# Altium project HPBIController.PrjPCB (part 1 of 2)
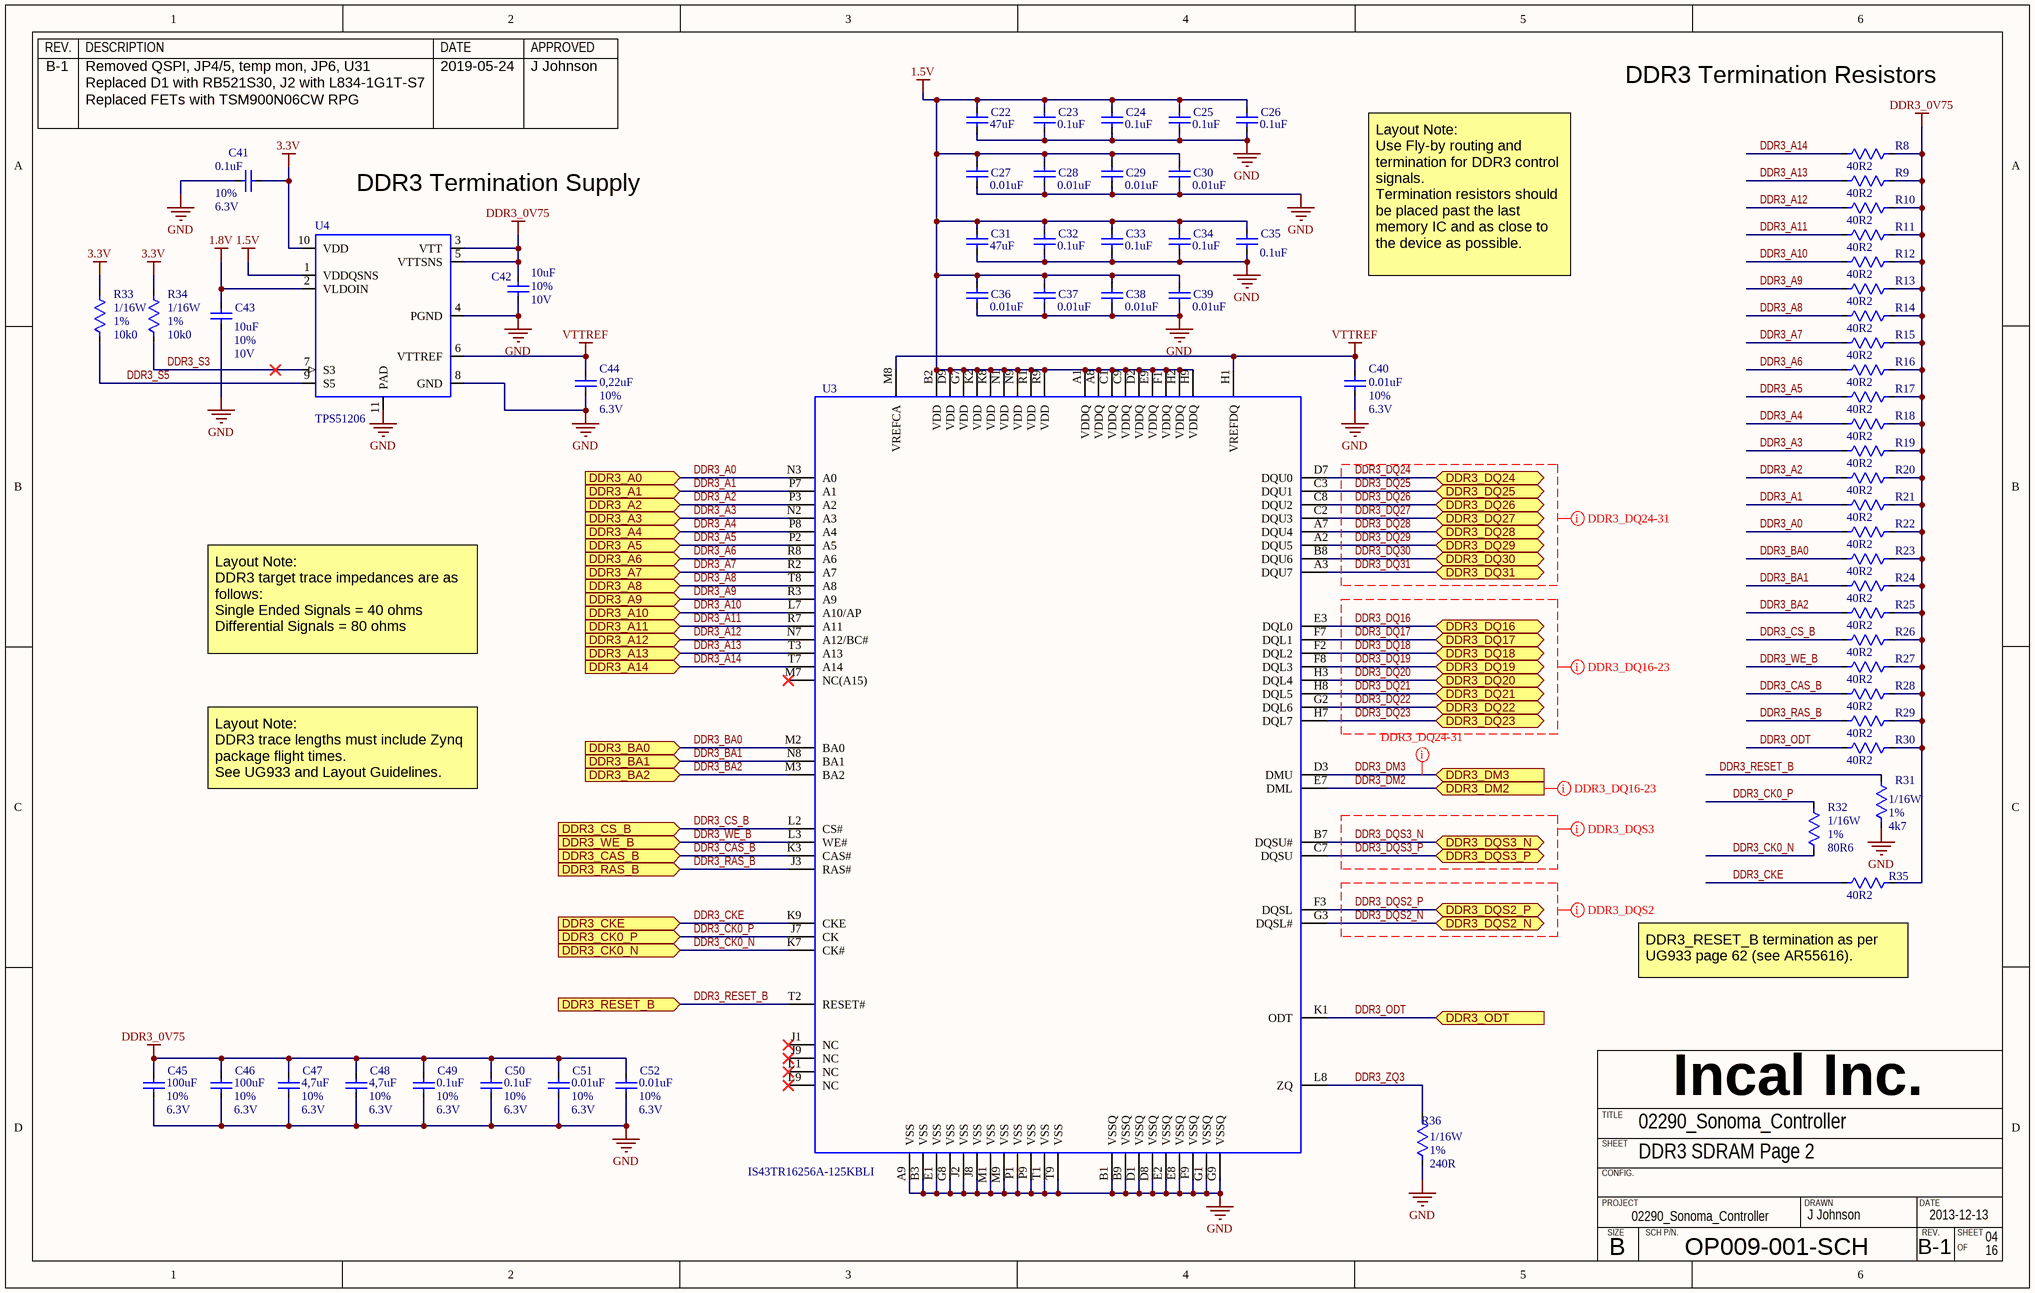
[diagram p0: DDR3B.SchDoc]
7 sheets, 255 parts. Net scope: hierarchical (ports join the sheet entries above them; power ports are global).
Board file: HPBIController-1.PcbDoc
Sheets:
  BlockDiagram.SchDoc
  DDR3B.SchDoc
  QSPIFlash.SchDoc
  Bank34-35.SchDoc
  Power.SchDoc
  ADC.SchDoc
  DAC.SchDoc

## Sheet BlockDiagram.SchDoc: 02290_Sonoma_Controller
size B; ApprovedBy: J Johnson; CheckedBy: J Johnson; Author: sdfasdfdfAEFfasdFfaF; DrawnBy: J Johnson; Organization: Opsero Electronic Design; Address1: 21-915 Av. Marguerite-Bourgeoys; Address2: Québec (QC); Address3: G1S 3X4; DocumentNumber: OP009-001-SCH; Revision: B-1; SheetNumber: 02; SheetTotal: 16; Tel1: (581) 308-8830; Tel2: (581) 308-8830; Project: 02290_Sonoma_Controller; CheckedDate: 2013-12-13; Sheet: Block diagram; PageSetup: Record=PageOptions|CenterHorizontal=True|CenterVertical=True|PrintScale=1.08|XCorrection=1.00|YCorrection=1.00|PrintKind=0|BorderSize=5000000|LeftOffset=0|BottomOffset=0|Orientation=2|PaperLength=1000|PaperWidth=1000|Scale=100|PaperSource=7|PrintQuality=-4|MediaType=1|DitherType=10|PaperKind=Tabloid     [11 x 17 in]|PrintScaleMode=1; DrawDate: 2013-12-13; SchTitle: 02290_Sonoma_Controller; RevDescription: Removed QSPI, JP4/5, temp mon, JP6, U31; RevDate: 2019-05-24; RevBy: J Johnson; RevDescription2: Replaced D1 with RB521S30, J2 with L834-1G1T-S7; RevDescription3: Replaced FETs with TSM900N06CW RPG

### Notes on the sheet
- REV.
- DESCRIPTION
- DATE
- APPROVED
- Incal Inc.
- SHEET
- TITLE
- CONFIG.
- PROJECT
- SIZE
- SCH P/N.
- DRAWN
- B
- OF

## Sheet DDR3B.SchDoc: 02290_Sonoma_Controller
size B; ApprovedBy: J Johnson; CheckedBy: J Johnson; Author: sdfasdfdfAEFfasdFfaF; DrawnBy: J Johnson; Organization: Opsero Electronic Design; Address1: 21-915 Av. Marguerite-Bourgeoys; Address2: Québec (QC); Address3: G1S 3X4; DocumentNumber: OP009-001-SCH; Revision: B-1; SheetNumber: 04; SheetTotal: 16; Tel1: (581) 308-8830; Tel2: (581) 308-8830; Project: 02290_Sonoma_Controller; CheckedDate: 2013-12-13; Sheet: DDR3 SDRAM Page 2; PageSetup: Record=PageOptions|CenterHorizontal=True|CenterVertical=True|PrintScale=1.08|XCorrection=1.00|YCorrection=1.00|PrintKind=0|BorderSize=5000000|LeftOffset=0|BottomOffset=0|Orientation=2|PaperLength=1000|PaperWidth=1000|Scale=100|PaperSource=7|PrintQuality=-4|MediaType=1|DitherType=10|PaperKind=Tabloid     [11 x 17 in]|PrintScaleMode=1; DrawDate: 2013-12-13; SchTitle: 02290_Sonoma_Controller; RevDescription: Removed QSPI, JP4/5, temp mon, JP6, U31; RevDate: 2019-05-24; RevBy: J Johnson; RevDescription2: Replaced D1 with RB521S30, J2 with L834-1G1T-S7; RevDescription3: Replaced FETs with TSM900N06CW RPG

### Parts
C22  value 47uF  [CAPC2013X125N]  (hidden comment: CAPACITOR_NP_TYPE1)
C23  value 0.1uF  [CAPC0603X33N]  (hidden comment: CAPACITOR_NP_TYPE1)
C24  value 0.1uF  [CAPC0603X33N]  (hidden comment: CAPACITOR_NP_TYPE1)
C25  value 0.1uF  [CAPC0603X33N]  (hidden comment: CAPACITOR_NP_TYPE1)
C26  value 0.1uF  [CAPC0603X33N]  (hidden comment: CAPACITOR_NP_TYPE1)
C27  value 0.01uF  [CAPC0603X33N]  (hidden comment: CAPACITOR_NP_TYPE1)
C28  value 0.01uF  [CAPC0603X33N]  (hidden comment: CAPACITOR_NP_TYPE1)
C29  value 0.01uF  [CAPC0603X33N]  (hidden comment: CAPACITOR_NP_TYPE1)
C30  value 0.01uF  [CAPC0603X33N]  (hidden comment: CAPACITOR_NP_TYPE1)
C31  value 47uF  [CAPC2013X125N]  (hidden comment: CAPACITOR_NP_TYPE1)
C32  value 0.1uF  [CAPC0603X33N]  (hidden comment: CAPACITOR_NP_TYPE1)
C33  value 0.1uF  [CAPC0603X33N]  (hidden comment: CAPACITOR_NP_TYPE1)
C34  value 0.1uF  [CAPC0603X33N]  (hidden comment: CAPACITOR_NP_TYPE1)
C35  value 0.1uF  [CAPC0603X33N]  (hidden comment: CAPACITOR_NP_TYPE1)
C36  value 0.01uF  [CAPC0603X33N]  (hidden comment: CAPACITOR_NP_TYPE1)
C37  value 0.01uF  [CAPC0603X33N]  (hidden comment: CAPACITOR_NP_TYPE1)
C38  value 0.01uF  [CAPC0603X33N]  (hidden comment: CAPACITOR_NP_TYPE1)
C39  value 0.01uF  [CAPC0603X33N]  (hidden comment: CAPACITOR_NP_TYPE1)
C40  value 0.01uF  Tolerance: 10%  Voltage: 6.3V  [CAPC0603X33N]  (hidden comment: CAPACITOR_NP_TYPE1)
C41  value 0.1uF  Tolerance: 10%  Voltage: 6.3V  [CAPC0603X33N]  (hidden comment: CAPACITOR_NP_TYPE1)
C42  value 10uF  Tolerance: 10%  Voltage: 10V  [CAPC1608X38N]  (hidden comment: CAPACITOR_NP_TYPE1)
C43  value 10uF  Tolerance: 10%  Voltage: 10V  [CAPC1608X38N]  (hidden comment: CAPACITOR_NP_TYPE1)
C44  value 0,22uF  Tolerance: 10%  Voltage: 6.3V  [CAPC1005X55N]  (hidden comment: CAPACITOR_NP_TYPE1)
C45  value 100uF  Tolerance: 10%  Voltage: 6.3V  [CAPC3225X250N]  (hidden comment: CAPACITOR_NP_TYPE1)
C46  value 100uF  Tolerance: 10%  Voltage: 6.3V  [CAPC3225X250N]  (hidden comment: CAPACITOR_NP_TYPE1)
C47  value 4,7uF  Tolerance: 10%  Voltage: 6.3V  [CAPC1005X33N]  (hidden comment: CAPACITOR_NP_TYPE1)
C48  value 4,7uF  Tolerance: 10%  Voltage: 6.3V  [CAPC1005X33N]  (hidden comment: CAPACITOR_NP_TYPE1)
C49  value 0.1uF  Tolerance: 10%  Voltage: 6.3V  [CAPC0603X33N]  (hidden comment: CAPACITOR_NP_TYPE1)
C50  value 0.1uF  Tolerance: 10%  Voltage: 6.3V  [CAPC0603X33N]  (hidden comment: CAPACITOR_NP_TYPE1)
C51  value 0.01uF  Tolerance: 10%  Voltage: 6.3V  [CAPC0603X33N]  (hidden comment: CAPACITOR_NP_TYPE1)
C52  value 0.01uF  Tolerance: 10%  Voltage: 6.3V  [CAPC0603X33N]  (hidden comment: CAPACITOR_NP_TYPE1)
R8  value 40R2  [RESC1005X33N]  (hidden comment: *)
R9  value 40R2  [RESC1005X33N]  (hidden comment: *)
R10  value 40R2  [RESC1005X33N]  (hidden comment: *)
R11  value 40R2  [RESC1005X33N]  (hidden comment: *)
R12  value 40R2  [RESC1005X33N]  (hidden comment: *)
R13  value 40R2  [RESC1005X33N]  (hidden comment: *)
R14  value 40R2  [RESC1005X33N]  (hidden comment: *)
R15  value 40R2  [RESC1005X33N]  (hidden comment: *)
R16  value 40R2  [RESC1005X33N]  (hidden comment: *)
R17  value 40R2  [RESC1005X33N]  (hidden comment: *)
R18  value 40R2  [RESC1005X33N]  (hidden comment: *)
R19  value 40R2  [RESC1005X33N]  (hidden comment: *)
R20  value 40R2  [RESC1005X33N]  (hidden comment: *)
R21  value 40R2  [RESC1005X33N]  (hidden comment: *)
R22  value 40R2  [RESC1005X33N]  (hidden comment: *)
R23  value 40R2  [RESC1005X33N]  (hidden comment: *)
R24  value 40R2  [RESC1005X33N]  (hidden comment: *)
R25  value 40R2  [RESC1005X33N]  (hidden comment: *)
R26  value 40R2  [RESC1005X33N]  (hidden comment: *)
R27  value 40R2  [RESC1005X33N]  (hidden comment: *)
R28  value 40R2  [RESC1005X33N]  (hidden comment: *)
R29  value 40R2  [RESC1005X33N]  (hidden comment: *)
R30  value 40R2  [RESC1005X33N]  (hidden comment: *)
R31  value 4k7  Power: 1/16W  Tolerance: 1%  [RESC1005X33N]  (hidden comment: *)
R32  value 80R6  Power: 1/16W  Tolerance: 1%  [RESC1005X33N]  (hidden comment: *)
R33  value 10k0  Power: 1/16W  Tolerance: 1%  [RESC1005X33N]  (hidden comment: *)
R34  value 10k0  Power: 1/16W  Tolerance: 1%  [RESC1005X33N]  (hidden comment: *)
R35  value 40R2  [RESC1005X33N]  (hidden comment: *)
R36  value 240R  Power: 1/16W  Tolerance: 1%  [RESC1005X33N]  (hidden comment: *)
U3  IS43TR16256A-125KBLI  [BGA96C80P6X16_900X1300X120]
U4  TPS51206  [DFN40P200X200X75-11N]

### Ports
DDR3_A0 (in), DDR3_A1 (in), DDR3_A2 (in), DDR3_A3 (in), DDR3_A4 (in), DDR3_A5 (in), DDR3_A6 (in), DDR3_A7 (in), DDR3_A8 (in), DDR3_A9 (in), DDR3_A10 (in), DDR3_A11 (in), DDR3_A12 (in), DDR3_A13 (in), DDR3_A14 (in), DDR3_BA0 (in), DDR3_BA1 (in), DDR3_BA2 (in), DDR3_CAS_B (in), DDR3_CK0_N (in), DDR3_CK0_P (in), DDR3_CKE (in), DDR3_CS_B (in), DDR3_DM2 (in), DDR3_DM3 (in), DDR3_DQ16 (bidir), DDR3_DQ17 (bidir), DDR3_DQ18 (bidir), DDR3_DQ19 (bidir), DDR3_DQ20 (bidir), DDR3_DQ21 (bidir), DDR3_DQ22 (bidir), DDR3_DQ23 (bidir), DDR3_DQ24 (bidir), DDR3_DQ25 (bidir), DDR3_DQ26 (bidir), DDR3_DQ27 (bidir), DDR3_DQ28 (bidir), DDR3_DQ29 (bidir), DDR3_DQ30 (bidir), DDR3_DQ31 (bidir), DDR3_DQS2_N (bidir), DDR3_DQS2_P (bidir), DDR3_DQS3_N (bidir), DDR3_DQS3_P (bidir), DDR3_ODT (in), DDR3_RAS_B (in), DDR3_RESET_B (in), DDR3_WE_B (in)

### Nets
1.5V: C22.1 C23.1 C24.1 C25.1 C26.1 C27.1 C28.1 C29.1 C30.1 C31.1 C32.1 C33.1 C34.1 C35.1 C36.1 C37.1 C38.1 C39.1 U3.A1(VDDQ) U3.A8(VDDQ) U3.B2(VDD) U3.C1(VDDQ) U3.C9(VDDQ) U3.D2(VDDQ) U3.D9(VDD) U3.E9(VDDQ) U3.F1(VDDQ) U3.G7(VDD) U3.H2(VDDQ) U3.H9(VDDQ) U3.K2(VDD) U3.K8(VDD) U3.N1(VDD) U3.N9(VDD) U3.R1(VDD) U3.R9(VDD) U4.1(VDDQSNS)
1.8V: C43.1 U4.2(VLDOIN)
3.3V: C41.1 R33.1 R34.1 U4.10(VDD)
DDR3_0V75: C42.1 C45.1 C46.1 C47.1 C48.1 C49.1 C50.1 C51.1 C52.1 R8.1 R9.1 R10.1 R11.1 R12.1 R13.1 R14.1 R15.1 R16.1 R17.1 R18.1 R19.1 R20.1 R21.1 R22.1 R23.1 R24.1 R25.1 R26.1 R27.1 R28.1 R29.1 R30.1 R35.1 U4.3(VTT) U4.5(VTTSNS)
GND: C22.2 C23.2 C24.2 C25.2 C26.2 C27.2 C28.2 C29.2 C30.2 C31.2 C32.2 C33.2 C34.2 C35.2 C36.2 C37.2 C38.2 C39.2 C40.2 C41.2 C42.2 C43.2 C44.2 C45.2 C46.2 C47.2 C48.2 C49.2 C50.2 C51.2 C52.2 R31.2 R36.1 U3.A9(VSS) U3.B1(VSSQ) U3.B3(VSS) U3.B9(VSSQ) U3.D1(VSSQ) U3.D8(VSSQ) U3.E1(VSS) U3.E2(VSSQ) U3.E8(VSSQ) U3.F9(VSSQ) U3.G1(VSSQ) U3.G8(VSS) U3.G9(VSSQ) U3.J2(VSS) U3.J8(VSS) U3.M1(VSS) U3.M9(VSS) U3.P1(VSS) U3.P9(VSS) U3.T1(VSS) U3.T9(VSS) U4.4(PGND) U4.8(GND) U4.11(PAD)
VTTREF: C40.1 C44.1 U3.H1(VREFDQ) U3.M8(VREFCA) U4.6(VTTREF)
DDR3_A0: R22.2 U3.N3(A0) ; port DDR3_A0
DDR3_A1: R21.2 U3.P7(A1) ; port DDR3_A1
DDR3_A2: R20.2 U3.P3(A2) ; port DDR3_A2
DDR3_A3: R19.2 U3.N2(A3) ; port DDR3_A3
DDR3_A4: R18.2 U3.P8(A4) ; port DDR3_A4
DDR3_A5: R17.2 U3.P2(A5) ; port DDR3_A5
DDR3_A6: R16.2 U3.R8(A6) ; port DDR3_A6
DDR3_A7: R15.2 U3.R2(A7) ; port DDR3_A7
DDR3_A8: R14.2 U3.T8(A8) ; port DDR3_A8
DDR3_A9: R13.2 U3.R3(A9) ; port DDR3_A9
DDR3_A10: R12.2 U3.L7(A10/AP) ; port DDR3_A10
DDR3_A11: R11.2 U3.R7(A11) ; port DDR3_A11
DDR3_A12: R10.2 U3.N7(A12/BC#) ; port DDR3_A12
DDR3_A13: R9.2 U3.T3(A13) ; port DDR3_A13
DDR3_A14: R8.2 U3.T7(A14) ; port DDR3_A14
DDR3_BA0: R23.2 U3.M2(BA0) ; port DDR3_BA0
DDR3_BA1: R24.2 U3.N8(BA1) ; port DDR3_BA1
DDR3_BA2: R25.2 U3.M3(BA2) ; port DDR3_BA2
DDR3_CAS_B: R28.2 U3.K3(CAS#) ; port DDR3_CAS_B
DDR3_CK0_N: R32.1 U3.K7(CK#) ; port DDR3_CK0_N
DDR3_CK0_P: R32.2 U3.J7(CK) ; port DDR3_CK0_P
DDR3_CKE: R35.2 U3.K9(CKE) ; port DDR3_CKE
DDR3_CS_B: R26.2 U3.L2(CS#) ; port DDR3_CS_B
DDR3_DM2: U3.E7(DML) ; port DDR3_DM2
DDR3_DM3: U3.D3(DMU) ; port DDR3_DM3
DDR3_DQ16: U3.E3(DQL0) ; port DDR3_DQ16
DDR3_DQ17: U3.F7(DQL1) ; port DDR3_DQ17
DDR3_DQ18: U3.F2(DQL2) ; port DDR3_DQ18
DDR3_DQ19: U3.F8(DQL3) ; port DDR3_DQ19
DDR3_DQ20: U3.H3(DQL4) ; port DDR3_DQ20
DDR3_DQ21: U3.H8(DQL5) ; port DDR3_DQ21
DDR3_DQ22: U3.G2(DQL6) ; port DDR3_DQ22
DDR3_DQ23: U3.H7(DQL7) ; port DDR3_DQ23
DDR3_DQ24: U3.D7(DQU0) ; port DDR3_DQ24
DDR3_DQ25: U3.C3(DQU1) ; port DDR3_DQ25
DDR3_DQ26: U3.C8(DQU2) ; port DDR3_DQ26
DDR3_DQ27: U3.C2(DQU3) ; port DDR3_DQ27
DDR3_DQ28: U3.A7(DQU4) ; port DDR3_DQ28
DDR3_DQ29: U3.A2(DQU5) ; port DDR3_DQ29
DDR3_DQ30: U3.B8(DQU6) ; port DDR3_DQ30
DDR3_DQ31: U3.A3(DQU7) ; port DDR3_DQ31
DDR3_DQS2_N: U3.G3(DQSL#) ; port DDR3_DQS2_N
DDR3_DQS2_P: U3.F3(DQSL) ; port DDR3_DQS2_P
DDR3_DQS3_N: U3.B7(DQSU#) ; port DDR3_DQS3_N
DDR3_DQS3_P: U3.C7(DQSU) ; port DDR3_DQS3_P
DDR3_ODT: R30.2 U3.K1(ODT) ; port DDR3_ODT
DDR3_RAS_B: R29.2 U3.J3(RAS#) ; port DDR3_RAS_B
DDR3_RESET_B: R31.1 U3.T2(RESET#) ; port DDR3_RESET_B
DDR3_S3: R34.2 U4.7(S3)
DDR3_S5: R33.2 U4.9(S5)
DDR3_WE_B: R27.2 U3.L3(WE#) ; port DDR3_WE_B
DDR3_ZQ3: R36.2 U3.L8(ZQ)

Not connected (* = marked no-connect by the designer): U3 J1(NC)* J9(NC)* L1(NC)* L9(NC)* M7(NC(A15))*

### Layout directives
net class DDR3_DQ3(24-31): DDR3_DM3, DDR3_DQ24, DDR3_DQ25, DDR3_DQ26, DDR3_DQ27, DDR3_DQ28, DDR3_DQ29, DDR3_DQ30, DDR3_DQ31
net class DDR3_DQ2(16-23): DDR3_DM2, DDR3_DQ16, DDR3_DQ17, DDR3_DQ18, DDR3_DQ19, DDR3_DQ20, DDR3_DQ21, DDR3_DQ22, DDR3_DQ23
net class DDR3_DQS3: DDR3_DQS3_N, DDR3_DQS3_P
net class DDR3_DQS2: DDR3_DQS2_N, DDR3_DQS2_P

### Notes on the sheet
- DDR3 Termination Resistors
- (near U4) DDR3 Termination Supply
- Layout Note:
  Use Fly-by routing and termination for DDR3 control signals.
  Termination resistors should be placed past the last memory IC and as close to the device as possible.
- Layout Note:
  DDR3 target trace impedances are as follows:
  Single Ended Signals = 40 ohms
  Differential Signals = 80 ohms
- Layout Note:
  DDR3 trace lengths must include Zynq package flight times.
  See UG933 and Layout Guidelines.
- (near R35) DDR3_RESET_B termination as per UG933 page 62 (see AR55616).
- REV.
- DESCRIPTION
- DATE
- APPROVED
- Incal Inc.
- SHEET
- TITLE
- CONFIG.
- PROJECT
- SIZE
- SCH P/N.
- DRAWN
- B
- OF

### Library data of the parts
C22 C31 = C0805_47uF_10%_25V_X5R: Capacitor ceramic, X5R, 47uF, 6.3V, 20%, -55 to +85 C,; Manufacturer 1: Taiyo; Mfg Part Number 1: JMK212BJ476MG-T; EIA(I) Package: 0805; EIA(M) Package: 2012; ASSY: USED; Status: Active; Power: *; Current: *; Part Ref: C0805_47uF_10%_25V_X5R; Comment_1: *; RoHs: True; Tolerance: 20%; Voltage: 6.3V; Operating Temp: -55 to +85 C
C23-C26 C32-C35 C41 C49 C50 = C0201_0.1uF_10%_6.3V_X5R: Capacitor ceramic, X5R, 0.1uF, 6.3V, 10%, -55 to +125 C, EIA0201; Manufacturer 1: Murata; Mfg Part Number 1: GRM033R60J104KE19D; EIA(I) Package: 0201; EIA(M) Package: 0603; ASSY: USED; Status: Active; Power: *; Current: *; Part Ref: C0201_0.1uF_10%_6.3V_X5R; Comment_1: *; RoHs: True; Operating Temp: -55 to +85 C
  C23-C26 C32-C35: Tolerance: 10%; Voltage: 6.3V
C27-C30 C36-C40 C51 C52 = C0201_0.01uF_10%_6.3V_X5R: Capacitor ceramic, X5R, 0.01uF, 6.3V, 10%, -55 to +125 C, EIA0201; Manufacturer 1: Murata; Mfg Part Number 1: GRM033R60J103KA01D; EIA(I) Package: 0201; EIA(M) Package: 0603; ASSY: USED; Status: Active; Power: *; Current: *; Part Ref: C0201_0.01uF_10%_6.3V_X5R; Comment_1: *; RoHs: True; Operating Temp: -55 to +85 C
  C27-C30 C36-C39: Tolerance: 10%; Voltage: 6.3V
C42 C43 = C0603_10uF_10%_10V_X5R: Capacitor ceramic, X5R, 10uF, 10V, 10%, -55 to +85 C, EIA0603; Manufacturer 1: TDK Corporation; Mfg Part Number 1: C1608X5R1A106K080AC; EIA(I) Package: 0603; EIA(M) Package: 1608; ASSY: USED; Status: Active; Power: *; Current: *; Part Ref: C0603_10uF_10%_10V_X5R; Comment_1: *; RoHs: True; Operating Temp: -55 to +85 C
C44 = C0402_0.22uF_10%_6.3V_X5R: Capacitor ceramic, X5R, 0.22uF, 6.3V, 10%, -55 to +85 C, EIA0402; Manufacturer 1: AVX; Mfg Part Number 1: 04026D224KAT2A; EIA(I) Package: 0402; EIA(M) Package: 1005; ASSY: USED; Status: Active; Power: *; Current: *; Part Ref: C0402_0.22uF_10%_6.3V_X5R; Comment_1: *; RoHs: True; Operating Temp: -55 to +85 C
C45 C46 = C1210_100uF_10%_6.3V_X5R: Capacitor ceramic, X5R, 100uF, 6.3V, 10%, -55 to +85 C, EIA1210; Manufacturer 1: Murata; Mfg Part Number 1: GRM32EF50J107ZE20K; EIA(I) Package: 1210; EIA(M) Package: 3225; ASSY: USED; Status: Active; Power: *; Current: *; Part Ref: C1210_100uF_10%_6.3V_X5R; Comment_1: *; RoHs: True; Operating Temp: -55 to +85 C; Datasheet 1: ..\datasheet\Capacitor\Murata\GRM_Serie\GRM32ER60J_X5R\2012-10-25
C47 C48 = C0402_4.7uF_20%_6.3V_X7R: Capacitor ceramic, X5R, 4,7uF, 6.3V, 10%, -55 to +85 C, EIA0402; Manufacturer 1: TDK; Mfg Part Number 1: C1005X5R0J475K; EIA(I) Package: 0402; EIA(M) Package: 1005; ASSY: USED; Status: Active; Power: *; Current: *; Part Ref: C0402_4.7uF_20%_6.3V_X7R; Comment_1: *; RoHs: True; Operating Temp: -55 to +85 C; Datasheet 1: ..\datasheet\Capacitor\TDK\C Series\2012-10-25
R8-R30 R35 = R0402_40R2_1%: Resistor, 40R2, 1/16W, 1%, -50 to +155 C, EIA0402, EIA(M)1005; Manufacturer 1: Yageo; Mfg Part Number 1: RC0402FR-0740R2L; EIA(I) Package: 0402; EIA(M) Package: 1005; Voltage: 50V; ASSY: USED; Status: Active; Part Ref: R0402_40R2_1%; Current: *; Comment_1: *; RoHs: True; Power: 1/16W; Tolerance: 1%; Operating Temp: -50 to +155 C; Datasheet 1: ..\datasheet\Resistor\Yaego\Thick_Film\RC0402\2012-03-29; Manufacturer 2: Vishay Dale; Mfg Part Number 2: CRCW040240R2FKED; Datasheet 2: ..\datasheet\Resistor\Vishay Dale\CRC\2012-03-29
R31 = R0402_4k70_1%: Resistor, 4k7, 1/16W, 1%, -55 to +155 C, EIA0402; Manufacturer 1: Yageo; Mfg Part Number 1: RC0402FR-074k7L; EIA(I) Package: 0402; EIA(M) Package: 1005; Voltage: 50V; ASSY: USED; Status: Active; Part Ref: R0402_4k70_1%; Current: *; Comment_1: *; RoHs: True; Operating Temp: -55 to +155 C; Datasheet 1: ..\datasheet\Resistor\Yaego\Thick_Film\RC0402\2012-03-29; Manufacturer 2: Vishay Dale; Mfg Part Number 2: CRCW04024k70FKED; Datasheet 2: ..\datasheet\Resistor\Vishay Dale\CRC\2012-03-29
R32 = R0402_80R6_1%: Resistor, 80R6, 1/16W, 1%, -50 to +155 C, EIA0402, EIA(M)1005; Manufacturer 1: Yageo; Mfg Part Number 1: RC0402FR-0780R6L; EIA(I) Package: 0402; EIA(M) Package: 1005; Voltage: 50V; ASSY: USED; Status: Active; Part Ref: R0402_80R6_1%; Current: *; Comment_1: *; RoHs: True; Operating Temp: -50 to +155 C; Datasheet 1: ..\datasheet\Resistor\Yaego\Thick_Film\RC0402\2012-03-29; Manufacturer 2: Vishay Dale; Mfg Part Number 2: CRCW040280R6FKED; Datasheet 2: ..\datasheet\Resistor\Vishay Dale\CRC\2012-03-29
R33 R34 = R0402_10k0_1%: Resistor, 10k0, 1/16W, 1%, -55 to +155 C, EIA0402; Manufacturer 1: Yageo; Mfg Part Number 1: RC0402FR-0710k0L; EIA(I) Package: 0402; EIA(M) Package: 1005; Voltage: 50V; ASSY: USED; Status: Active; Part Ref: R0402_10k0_1%; Current: *; Comment_1: *; RoHs: True; Package: 0402; Operating Temp: -55 to +155 C; Datasheet 1: ..\datasheet\Resistor\Yaego\Thick_Film\RC0402\2012-03-29; Manufacturer 2: Vishay Dale; Mfg Part Number 2: CRCW040210k0FKED; Datasheet 2: ..\datasheet\Resistor\Vishay Dale\CRC\2012-03-29
R36 = R0402_240R_1%: Resistor, 240R, 1/16W, 1%, -50 to +155 C, EIA0402, EIA(M)1005; Manufacturer 1: Vishay Dale; Mfg Part Number 1: CRCW0402240RFKED; EIA(I) Package: 0402; EIA(M) Package: 1005; Voltage: 50V; ASSY: USED; Status: Active; Part Ref: R0402_240R_1%; Current: *; Comment_1: *; RoHs: True; Operating Temp: -50 to +155 C
U3 = IS43TR16256A-125KBLI: DDR3 SDRAM, 512Mx8, 256Mx16 4Gb; Manufacturer 1: ISSI; PART NUMBER: IS43TR16256A-125KBLI; Part Ref: IS43TR16256A-125KBLI; Status: Active; RoHs: False; Value: IS43TR16256A-125KBLI; Mfg Part Number 1: IS43TR16256A-125KBLI
U4 = TPS51206: DDR Termination Regulator, -40 to +85 C; Manufacturer 1: Texas Instruments; Mfg Part Number 1: TPS51206DSQT; Voltage: 3.3V or 5V; Current: 2A; PART NUMBER: TPS51206; Part Ref: TPS51206; Status: Active; RoHs: True; Value: TPS51206; Operating Temp: -40 to +85 C

## Sheet QSPIFlash.SchDoc: 02290_Sonoma_Controller
size B; ApprovedBy: J Johnson; CheckedBy: J Johnson; Author: sdfasdfdfAEFfasdFfaF; DrawnBy: J Johnson; Organization: Opsero Electronic Design; Address1: 21-915 Av. Marguerite-Bourgeoys; Address2: Québec (QC); Address3: G1S 3X4; DocumentNumber: OP009-001-SCH; Revision: B-1; SheetNumber: 06; SheetTotal: 16; Tel1: (581) 308-8830; Tel2: (581) 308-8830; Project: 02290_Sonoma_Controller; CheckedDate: 2013-12-13; Sheet: QSPI Flash; PageSetup: Record=PageOptions|CenterHorizontal=True|CenterVertical=True|PrintScale=1.08|XCorrection=1.00|YCorrection=1.00|PrintKind=0|BorderSize=5000000|LeftOffset=0|BottomOffset=0|Orientation=2|PaperLength=1000|PaperWidth=1000|Scale=100|PaperSource=7|PrintQuality=-4|MediaType=1|DitherType=10|PaperKind=Tabloid     [11 x 17 in]|PrintScaleMode=1; DrawDate: 2013-12-13; SchTitle: 02290_Sonoma_Controller; RevDescription: Removed QSPI, JP4/5, temp mon, JP6, U31; RevDate: 2019-05-24; RevBy: J Johnson; RevDescription2: Replaced D1 with RB521S30, J2 with L834-1G1T-S7; RevDescription3: Replaced FETs with TSM900N06CW RPG
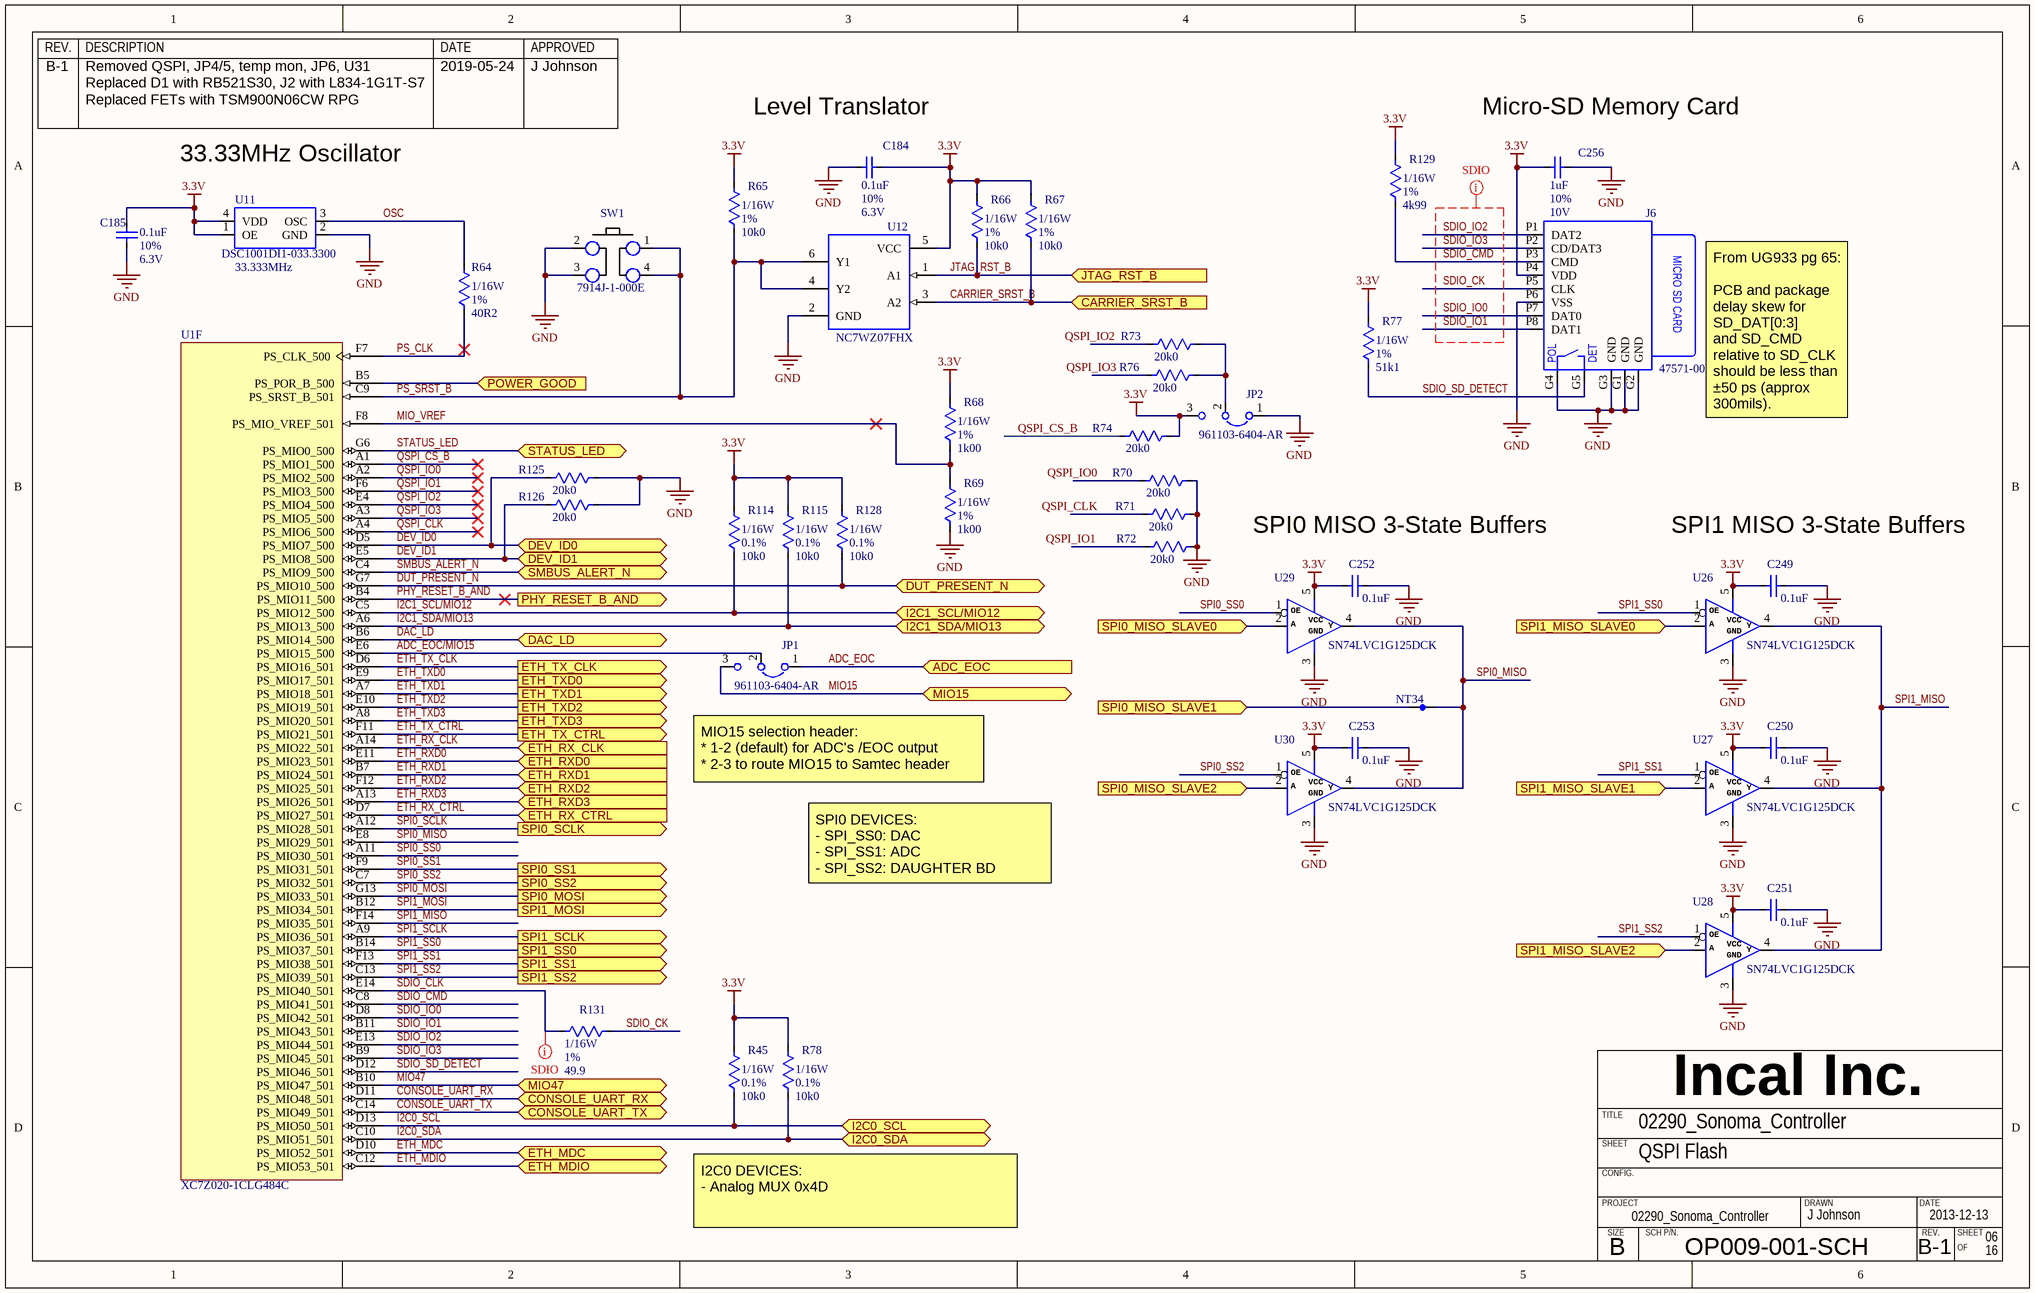
[diagram p1: QSPIFlash.SchDoc]

### Parts
C184  value 0.1uF  Tolerance: 10%  Voltage: 6.3V  [CAPC0603X33N]  (hidden comment: CAPACITOR_NP_TYPE1)
C185  value 0.1uF  Tolerance: 10%  Voltage: 6.3V  [CAPC0603X33N]  (hidden comment: CAPACITOR_NP_TYPE1)
C249  value 0.1uF  [CAPC0603X33N]  (hidden comment: CAPACITOR_NP_TYPE1)
C250  value 0.1uF  [CAPC0603X33N]  (hidden comment: CAPACITOR_NP_TYPE1)
C251  value 0.1uF  [CAPC0603X33N]  (hidden comment: CAPACITOR_NP_TYPE1)
C252  value 0.1uF  [CAPC0603X33N]  (hidden comment: CAPACITOR_NP_TYPE1)
C253  value 0.1uF  [CAPC0603X33N]  (hidden comment: CAPACITOR_NP_TYPE1)
C256  value 1uF  Tolerance: 10%  Voltage: 10V  [CAPC1005X33N]  (hidden comment: CAPACITOR_NP_TYPE1)
J6  SD_MICRO_DET1  [47571-0001]  (value not drawn)
JP1  Mfg Part Number 1: 961103-6404-AR  [JMPR3P254_SHUNT12]  (hidden comment: JP_HDR3x1_DEF1)
JP2  Mfg Part Number 1: 961103-6404-AR  [3PIN_HEADER]  (hidden comment: JP_HDR3x1_DEF1)
NT34  NET_TIE_1X1  [NET_TIE_1X1]  (value not drawn)  (net tie, no BOM)
R45  value 10k0  Power: 1/16W  Tolerance: 0.1%  [RESC1005X33N]  (hidden comment: *)
R64  value 40R2  Power: 1/16W  Tolerance: 1%  [RESC1005X33N]  (hidden comment: *)
R65  value 10k0  Power: 1/16W  Tolerance: 1%  [RESC1005X33N]  (hidden comment: *)
R66  value 10k0  Power: 1/16W  Tolerance: 1%  [RESC1005X33N]  (hidden comment: *)
R67  value 10k0  Power: 1/16W  Tolerance: 1%  [RESC1005X33N]  (hidden comment: *)
R68  value 1k00  Power: 1/16W  Tolerance: 1%  [RESC1005X33N]  (hidden comment: *)
R69  value 1k00  Power: 1/16W  Tolerance: 1%  [RESC1005X33N]  (hidden comment: *)
R70  value 20k0  [0402]  (hidden comment: *)
R71  value 20k0  [0402]  (hidden comment: *)
R72  value 20k0  [RESC1005X33N]  (hidden comment: *)
R73  value 20k0  [0402]  (hidden comment: *)
R74  value 20k0  [0402]  (hidden comment: *)
R76  value 20k0  [0402]  (hidden comment: *)
R77  value 51k1  Power: 1/16W  Tolerance: 1%  [RESC1005X33N]  (hidden comment: *)
R78  value 10k0  Power: 1/16W  Tolerance: 0.1%  [RESC1005X33N]  (hidden comment: *)
R114  value 10k0  Power: 1/16W  Tolerance: 0.1%  [RESC1005X33N]  (hidden comment: *)
R115  value 10k0  Power: 1/16W  Tolerance: 0.1%  [RESC1005X33N]  (hidden comment: *)
R125  value 20k0  [RESC1005X33N]  (hidden comment: *)
R126  value 20k0  [RESC1005X33N]  (hidden comment: *)
R128  value 10k0  Power: 1/16W  Tolerance: 0.1%  [RESC1005X33N]  (hidden comment: *)
R129  value 4k99  Power: 1/16W  Tolerance: 1%  [RESC1005X33N]  (hidden comment: *)
R131  value 49.9  Power: 1/16W  Tolerance: 1%  [RESC1005X33N]  (hidden comment: *)
SW1  value 7914J-1-000E  [7914J-1-000E]  (hidden comment: SW_SPST_TYPE1)
U1  XC7Z020-1CLG484C  [CLG484]  (part F of 10)
U11  value 33.333MHz  Mfg Part Number 1: DSC1001DI1-033.3300  [OSCSC165P200X250X85-4N]  (hidden comment: OSCILLATOR_TYPE1)
U12  NC7WZ07FHX  [DFN35P100X100X55-6N]
U26  value SN74LVC1G125DCK  [SOT65P210X110-5N]  (hidden comment: TINY_SCHM_BUF_TRIS_TYPE1)
U27  value SN74LVC1G125DCK  [SOT65P210X110-5N]  (hidden comment: TINY_SCHM_BUF_TRIS_TYPE1)
U28  value SN74LVC1G125DCK  [SOT65P210X110-5N]  (hidden comment: TINY_SCHM_BUF_TRIS_TYPE1)
U29  value SN74LVC1G125DCK  [SOT65P210X110-5N]  (hidden comment: TINY_SCHM_BUF_TRIS_TYPE1)
U30  value SN74LVC1G125DCK  [SOT65P210X110-5N]  (hidden comment: TINY_SCHM_BUF_TRIS_TYPE1)

### Ports
ADC_EOC (in), CARRIER_SRST_B (in), CONSOLE_UART_RX (bidir), CONSOLE_UART_TX (bidir), DAC_LD (bidir), DEV_ID0 (bidir), DEV_ID1 (bidir), DUT_PRESENT_N (bidir), ETH_MDC (bidir), ETH_MDIO (bidir), ETH_RX_CLK (in), ETH_RX_CTRL (in), ETH_RXD0 (in), ETH_RXD1 (in), ETH_RXD2 (in), ETH_RXD3 (in), ETH_TX_CLK (out), ETH_TX_CTRL (out), ETH_TXD0 (out), ETH_TXD1 (out), ETH_TXD2 (out), ETH_TXD3 (out), I2C0_SCL (bidir), I2C0_SDA (bidir), I2C1_SCL/MIO12 (bidir), I2C1_SDA/MIO13 (bidir), JTAG_RST_B (in), MIO15 (bidir), MIO47 (bidir), PHY_RESET_B_AND (out), POWER_GOOD (in), SMBUS_ALERT_N (bidir), SPI0_MISO_SLAVE0 (in), SPI0_MISO_SLAVE1 (in), SPI0_MISO_SLAVE2 (in), SPI0_MOSI (out), SPI0_SCLK (out), SPI0_SS1 (out), SPI0_SS2 (out), SPI1_MISO_SLAVE0 (in), SPI1_MISO_SLAVE1 (in), SPI1_MISO_SLAVE2 (in), SPI1_MOSI (out), SPI1_SCLK (out), SPI1_SS0 (out), SPI1_SS1 (out), SPI1_SS2 (out), STATUS_LED (bidir)

### Nets
3.3V: C184.1 C185.1 C249.1 C250.1 C251.1 C252.1 C253.1 C256.1 J6.P4(VDD) JP2.3 R45.1 R65.2 R66.2 R67.2 R68.1 R74.2 R77.1 R78.1 R114.1 R115.1 R128.1 R129.1 U11.1(OE) U11.4(VDD) U12.5(VCC) U26.5(VCC) U27.5(VCC) U28.5(VCC) U29.5(VCC) U30.5(VCC)
GND: C184.2 C185.2 C249.2 C250.2 C251.2 C252.2 C253.2 C256.2 J6.G1(GND) J6.G2(GND) J6.G3(GND) J6.G4(POL) J6.P6(VSS) JP2.1 R69.2 R70.2 R71.2 R72.2 R125.2 R126.2 SW1.2 SW1.3 U11.2(GND) U12.2(GND) U26.3(GND) U27.3(GND) U28.3(GND) U29.3(GND) U30.3(GND)
ADC_EOC: JP1.1 ; port ADC_EOC
ADC_EOC/MIO15: JP1.2 U1.E6(PS_MIO15_500)
CARRIER_SRST_B: R67.1 U12.3(A2) ; port CARRIER_SRST_B
CONSOLE_UART_RX: U1.D11(PS_MIO48_501) ; port CONSOLE_UART_RX
CONSOLE_UART_TX: U1.C14(PS_MIO49_501) ; port CONSOLE_UART_TX
DAC_LD: U1.B6(PS_MIO14_500) ; port DAC_LD
DEV_ID0: R125.1 U1.D5(PS_MIO7_500) ; port DEV_ID0
DEV_ID1: R126.1 U1.E5(PS_MIO8_500) ; port DEV_ID1
DUT_PRESENT_N: R128.2 U1.G7(PS_MIO10_500) ; port DUT_PRESENT_N
ETH_MDC: U1.D10(PS_MIO52_501) ; port ETH_MDC
ETH_MDIO: U1.C12(PS_MIO53_501) ; port ETH_MDIO
ETH_RX_CLK: U1.A14(PS_MIO22_501) ; port ETH_RX_CLK
ETH_RX_CTRL: U1.D7(PS_MIO27_501) ; port ETH_RX_CTRL
ETH_RXD0: U1.E11(PS_MIO23_501) ; port ETH_RXD0
ETH_RXD1: U1.B7(PS_MIO24_501) ; port ETH_RXD1
ETH_RXD2: U1.F12(PS_MIO25_501) ; port ETH_RXD2
ETH_RXD3: U1.A13(PS_MIO26_501) ; port ETH_RXD3
ETH_TX_CLK: U1.D6(PS_MIO16_501) ; port ETH_TX_CLK
ETH_TX_CTRL: U1.F11(PS_MIO21_501) ; port ETH_TX_CTRL
ETH_TXD0: U1.E9(PS_MIO17_501) ; port ETH_TXD0
ETH_TXD1: U1.A7(PS_MIO18_501) ; port ETH_TXD1
ETH_TXD2: U1.E10(PS_MIO19_501) ; port ETH_TXD2
ETH_TXD3: U1.A8(PS_MIO20_501) ; port ETH_TXD3
I2C0_SCL: R45.2 U1.D13(PS_MIO50_501) ; port I2C0_SCL
I2C0_SDA: R78.2 U1.C10(PS_MIO51_501) ; port I2C0_SDA
I2C1_SCL/MIO12: R114.2 U1.C5(PS_MIO12_500) ; port I2C1_SCL/MIO12
I2C1_SDA/MIO13: R115.2 U1.A6(PS_MIO13_500) ; port I2C1_SDA/MIO13
JTAG_RST_B: R66.1 U12.1(A1) ; port JTAG_RST_B
MIO15: JP1.3 ; port MIO15
MIO47: U1.B10(PS_MIO47_501) ; port MIO47
MIO_VREF: R68.2 R69.1 U1.F8(PS_MIO_VREF_501)
OSC: R64.1 U11.3(OSC)
PHY_RESET_B_AND: U1.B4(PS_MIO11_500) ; port PHY_RESET_B_AND
POWER_GOOD: U1.B5(PS_POR_B_500) ; port POWER_GOOD
PS_CLK: R64.2 U1.F7(PS_CLK_500)
PS_SRST_B: R65.1 SW1.1 SW1.4 U1.C9(PS_SRST_B_501) U12.4(Y2) U12.6(Y1)
QSPI_CLK: R71.1 U1.A4(PS_MIO6_500)
QSPI_CS_B: R74.1 U1.A1(PS_MIO1_500)
QSPI_IO0: R70.1 U1.A2(PS_MIO2_500)
QSPI_IO1: R72.1 U1.F6(PS_MIO3_500)
QSPI_IO2: R73.1 U1.E4(PS_MIO4_500)
QSPI_IO3: R76.1 U1.A3(PS_MIO5_500)
SDIO_CK: J6.P5(CLK) R131.2
SDIO_CLK: R131.1 U1.E14(PS_MIO40_501)
SDIO_CMD: J6.P3(CMD) R129.2 U1.C8(PS_MIO41_501)
SDIO_IO0: J6.P7(DAT0) U1.D8(PS_MIO42_501)
SDIO_IO1: J6.P8(DAT1) U1.B11(PS_MIO43_501)
SDIO_IO2: J6.P1(DAT2) U1.E13(PS_MIO44_501)
SDIO_IO3: J6.P2(CD/DAT3) U1.B9(PS_MIO45_501)
SDIO_SD_DETECT: J6.G5(DET) R77.2 U1.D12(PS_MIO46_501)
SMBUS_ALERT_N: U1.C4(PS_MIO9_500) ; port SMBUS_ALERT_N
SPI0_MISO: NT34.2 U1.E8(PS_MIO29_501) U29.4(Y) U30.4(Y)
SPI0_MISO_SLAVE0: U29.2(A) ; port SPI0_MISO_SLAVE0
SPI0_MISO_SLAVE1: NT34.1 ; port SPI0_MISO_SLAVE1
SPI0_MISO_SLAVE2: U30.2(A) ; port SPI0_MISO_SLAVE2
SPI0_MOSI: U1.G13(PS_MIO33_501) ; port SPI0_MOSI
SPI0_SCLK: U1.A12(PS_MIO28_501) ; port SPI0_SCLK
SPI0_SS0: U1.A11(PS_MIO30_501) U29.1(~{OE})
SPI0_SS1: U1.F9(PS_MIO31_501) ; port SPI0_SS1
SPI0_SS2: U1.C7(PS_MIO32_501) U30.1(~{OE}) ; port SPI0_SS2
SPI1_MISO: U1.F14(PS_MIO35_501) U26.4(Y) U27.4(Y) U28.4(Y)
SPI1_MISO_SLAVE0: U26.2(A) ; port SPI1_MISO_SLAVE0
SPI1_MISO_SLAVE1: U27.2(A) ; port SPI1_MISO_SLAVE1
SPI1_MISO_SLAVE2: U28.2(A) ; port SPI1_MISO_SLAVE2
SPI1_MOSI: U1.B12(PS_MIO34_501) ; port SPI1_MOSI
SPI1_SCLK: U1.A9(PS_MIO36_501) ; port SPI1_SCLK
SPI1_SS0: U1.B14(PS_MIO37_501) U26.1(~{OE}) ; port SPI1_SS0
SPI1_SS1: U1.F13(PS_MIO38_501) U27.1(~{OE}) ; port SPI1_SS1
SPI1_SS2: U1.C13(PS_MIO39_501) U28.1(~{OE}) ; port SPI1_SS2
STATUS_LED: U1.G6(PS_MIO0_500) ; port STATUS_LED
NetJP2_2: JP2.2 R73.2 R76.2

### Layout directives
net class SDIO: SDIO_CK, SDIO_CLK, SDIO_CMD, SDIO_IO0, SDIO_IO1, SDIO_IO2, SDIO_IO3

### Notes on the sheet
- 33.33MHz Oscillator
- Level Translator
- (near C256) Micro-SD Memory Card
- From UG933 pg 65:
  PCB and package delay skew for SD_DAT[0:3]
  and SD_CMD relative to SD_CLK should be less than ±50 ps (approx 300mils).
- SPI0 MISO 3-State Buffers
- SPI1 MISO 3-State Buffers
- (near JP1) MIO15 selection header:
  * 1-2 (default) for ADC's /EOC output
  * 2-3 to route MIO15 to Samtec header
- SPI0 DEVICES:
  - SPI_SS0: DAC
  - SPI_SS1: ADC
  - SPI_SS2: DAUGHTER BD
- I2C0 DEVICES:
  - Analog MUX 0x4D
- REV.
- DESCRIPTION
- DATE
- APPROVED
- Incal Inc.
- SHEET
- TITLE
- CONFIG.
- PROJECT
- SIZE
- SCH P/N.
- DRAWN
- B
- OF
- (in symbol 47571-0001) MICRO SD CARD
- (in symbol SN74LVC1G125DCK) OE

### Library data of the parts
C184 C185 C249-C253 = C0201_0.1uF_10%_6.3V_X5R: as C23 on sheet DDR3B; Status: Active; Power: *; Current: *; Part Ref: C0201_0.1uF_10%_6.3V_X5R; Comment_1: *; RoHs: True; Operating Temp: -55 to +85 C
  C249-C253: Tolerance: 10%; Voltage: 6.3V
C256 = C0402_1uF_10%_10V_X5R: Capacitor ceramic, X5R, 1uF, 10V, 10%, -55 to +85 C, EIA0402; Manufacturer 1: Murata; Mfg Part Number 1: GRM155R61A105KE15J; EIA(I) Package: 0402; EIA(M) Package: 1005; ASSY: USED; Status: Active; Power: *; Current: *; Part Ref: C0402_1uF_10%_10V_X5R; Comment_1: *; RoHs: True; Operating Temp: -55 to +85 C
J6 = 47571-0001: MicroSD Card Header with Detect, 9 pin, RA, 1.10 mm, SMT, -40 to +85C; Manufacturer 1: Molex; ASSY: USED; Power: Pow; Current: Cur; Voltage: Vol; Comment_1: Com; Status: Active; EIA(I) Package: *; EIA(M) Package: *; Part Ref: 47571-0001; Tolerance: *; Package: *; RoHs: True; Value: 47571-0001; Operating Temp: -40 to +85C; Mfg Part Number 1: 47571-0001
JP1 JP2 = JP_HDR3x1_DEF1: Jumper Header .100'', 3-pin, Default position 1-2, TH; Manufacturer 1: 3M; ASSY: USED; Power: Pow; Current: Cur; Voltage: Vol; Value: 961103-6404-AR; Status: Active; EIA(I) Package: *; EIA(M) Package: *; Part Ref: JP_HDR3x1_DEF1; Tolerance: *; Package: *; RoHs: True; Datasheet 1: ..\datasheet\Connector\3M\961102-6404-AR
NT34 = NET_TIE_1X1: Net Tie 1 to 1; ASSY: USED; Status: Active; Power: *; Current: *; EIA(I) Package: *; EIA(M) Package: *; Part Ref: NET_TIE_1X1; Comment_1: *; RoHs: True; Value: NET_TIE; Tolerance: *; Voltage: *
R45 R78 R114 R115 R128 = R0402_10k0_0.1%: Resistor, 10k0, 1/16W, 0.1%, -50 to +155 C, EIA0402; Manufacturer 1: Panasonic - ECG; Mfg Part Number 1: ERA-2AEB103X; EIA(I) Package: 0402; EIA(M) Package: 1005; Voltage: 50V; ASSY: USED; Status: Active; Part Ref: R0402_10k0_0.1%; Current: *; Comment_1: *; RoHs: True; Package: 0402; Operating Temp: -50 to +155 C; Datasheet 1: ..\datasheet\Resistor\Panasonic ECG\ERA\2012-10-25; Manufacturer 2: Vishay Dale; Mfg Part Number 2: TNPW040210K0BEED; Datasheet 2: ..\datasheet\Resistor\Vishay Dale\TNPW\2012-03-29
R64 = R0402_40R2_1%: as R8 on sheet DDR3B; Status: Active; Part Ref: R0402_40R2_1%; Current: *; Comment_1: *; RoHs: True; Operating Temp: -50 to +155 C; Datasheet 1: ..\datasheet\Resistor\Yaego\Thick_Film\RC0402\2012-03-29; Manufacturer 2: Vishay Dale; Mfg Part Number 2: CRCW040240R2FKED; Datasheet 2: ..\datasheet\Resistor\Vishay Dale\CRC\2012-03-29
R65-R67 = R0402_10k0_1%: as R33 on sheet DDR3B; Status: Active; Part Ref: R0402_10k0_1%; Current: *; Comment_1: *; RoHs: True; Package: 0402; Operating Temp: -55 to +155 C; Datasheet 1: ..\datasheet\Resistor\Yaego\Thick_Film\RC0402\2012-03-29; Manufacturer 2: Vishay Dale; Mfg Part Number 2: CRCW040210k0FKED; Datasheet 2: ..\datasheet\Resistor\Vishay Dale\CRC\2012-03-29
R68 R69 = R0402_1k00_1%: Resistor, 1k00, 1/16W, 1%, -55 to +155 C, EIA0402; Manufacturer 1: Yageo; Mfg Part Number 1: RC0402FR-071K00L; EIA(I) Package: 0402; EIA(M) Package: 1005; Voltage: 50V; ASSY: USED; Status: Active; Part Ref: R0402_1k00_1%; Current: *; Comment_1: *; RoHs: True; Operating Temp: -55 to +155 C; Datasheet 1: ..\datasheet\Resistor\Yaego\Thick_Film\RC0402\2012-03-29; Manufacturer 2: Vishay Dale; Mfg Part Number 2: CRCW04021k00FKED; Datasheet 2: ..\datasheet\Resistor\Vishay Dale\CRC\2012-03-29
R70 R71 R73 R74 R76 = R0402_20k0_1%: Resistor, 20k0, 1/16W, 1%, -50 to +155 C, EIA0402, EIA(M)1005; Manufacturer 1: Yageo; Mfg Part Number 1: RC0402FR-0720k0L; EIA(M) Package: 1005; Voltage: 50V; ASSY: USED; Status: Active; EIA(I) Package: 0402; Part Ref: R0402_20k0_1%; Current: *; Comment_1: *; RoHs: True; Power: 1/16W; Tolerance: 1%; Operating Temp: -50 to +155 C; Datasheet 1: ..\datasheet\Resistor\Yaego\Thick_Film\RC0402\2012-03-29; Manufacturer 2: Vishay Dale; Mfg Part Number 2: CRCW040220k0FKED; Datasheet 2: ..\datasheet\Resistor\Vishay Dale\CRC\2012-03-29
R72 R125 R126 = R0402_20k0_1%: Resistor, 20k0, 1/16W, 1%, -50 to +155 C, EIA0402, EIA(M)1005; Manufacturer 1: Yageo; Mfg Part Number 1: RC0402FR-0720k0L; EIA(I) Package: 0402; EIA(M) Package: 1005; Voltage: 50V; ASSY: USED; Status: Active; Part Ref: R0402_20k0_1%; Current: *; Comment_1: *; RoHs: True; Power: 1/16W; Tolerance: 1%; Operating Temp: -50 to +155 C; Datasheet 1: ..\datasheet\Resistor\Yaego\Thick_Film\RC0402\2012-03-29; Manufacturer 2: Vishay Dale; Mfg Part Number 2: CRCW040220k0FKED; Datasheet 2: ..\datasheet\Resistor\Vishay Dale\CRC\2012-03-29
R77 R131 = R0402_51k1_1%: Resistor, 51k1, 1/16W, 1%, -50 to +155 C, EIA0402, EIA(M)1005; Manufacturer 1: Yageo; Mfg Part Number 1: RC0402FR-0751k1L; EIA(I) Package: 0402; EIA(M) Package: 1005; Voltage: 50V; ASSY: USED; Status: Active; Part Ref: R0402_51k1_1%; Current: *; Comment_1: *; RoHs: True; Operating Temp: -50 to +155 C; Datasheet 1: ..\datasheet\Resistor\Yaego\Thick_Film\RC0402\2012-03-29; Manufacturer 2: Vishay Dale; Mfg Part Number 2: CRCW040251k1FKED; Datasheet 2: ..\datasheet\Resistor\Vishay Dale\CRC\2012-03-29
R129 = R0402_4k99_1%: Resistor, 4k99, 1/16W, 1%, -50 to +155 C, EIA0402, EIA(M)1005; Manufacturer 1: Yageo; Mfg Part Number 1: RC0402FR-074k99L; EIA(I) Package: 0402; EIA(M) Package: 1005; Voltage: 50V; ASSY: USED; Status: Active; Part Ref: R0402_4k99_1%; Current: *; Comment_1: *; RoHs: True; Operating Temp: -50 to +155 C; Datasheet 1: ..\datasheet\Resistor\Yaego\Thick_Film\RC0402\2012-03-29; Manufacturer 2: Vishay Dale; Mfg Part Number 2: CRCW04024k99FKED; Datasheet 2: ..\datasheet\Resistor\Vishay Dale\CRC\2012-03-29
SW1 = 7914J-1-000E: Switch, tactile, 39V, 4mm, -55 to +125 C, SMD; Manufacturer 1: Bourns; ASSY: USED; Power: Pow; Current: 100mA; Comment_1: Com; Status: Active; EIA(I) Package: *; EIA(M) Package: *; Part Ref: 7914J-1-000E; Tolerance: *; Voltage: 39V; Package: *; RoHs: True; Operating Temp: -55 to +125 C; Mfg Part Number 1: 7914J-1-000E
U1 = XC7Z020-1CLG484C: 667 MHz Zynq™-7000 AP SoC, 130 PS I/O, 200 FPGA I/O, 484-Ball BGA, Speed Grade 1, Commercial Grade; Manufacturer: Xilinx; Extensible Block RAM (# 36Kb Blocks): 560 KB (140); Flip Flops: 106400; LUTs: 53200; Speed Grade: -1; DatasheetVersion: v1.2; PackageVersion: Rev 1.1; PackageReference: CLG484; PackageDescription: Wire-Bond Chip-Scale BGA, Body 19 x 19 mm, 0.8 mm Pitch; Generic Part Number: XC7Z020; RoHS: True; Mounting Technology: Surface Mount; Code_JEDEC: MO-275-PPAA-2; PartNumber: XC7Z020-1CLG484C; ComponentLink1Description: Datasheet; ComponentLink1URL: http://www.xilinx.com/support/documentation/data_sheets/ds190-Zynq-7000-Overview.pdf; ComponentLink2Description: Package Specification; ComponentLink2URL: http://www.xilinx.com/support/documentation/user_guides/ug865-Zynq-7000-Pkg-Pinout.pdf; ComponentLink3Description: DC and AC Switching Characteristics; ComponentLink3URL: http://www.xilinx.com/support/documentation/data_sheets/ds187-XC7Z010-XC7Z020-Data-Sheet.pdf; ComponentLink4Description: Package File; ComponentLink4URL: http://www.xilinx.com/support/packagefiles/z7packages/xc7z020clg484pkg.txt; ComponentLink5Description: Packaging and Pinout; ComponentLink5URL: http://www.xilinx.com/support/documentation/user_guides/ug865-Zynq-7000-Pkg-Pinout.pdf; ComponentLink6Description: PCB and Layout Guide; ComponentLink6URL: http://www.xilinx.com/support/documentation/user_guides/ug483_7Series_PCB.pdf; Part Ref: XC7Z020-1CLG484C; Status: Active; Value: XC7Z020-1CLG484C; Manufacturer 1: Xilinx; Mfg Part Number 1: XC7Z020-1CLG484C; Package: CLG484
U11 = DSC1001DI1-033.3300: Oscillator, CMOS, 33.333MHz, 50ppm, 1.7V to 3.6V, -40 to +85C, SMT; Manufacturer 1: Discera; ASSY: USED; Status: Active; Power: *; EIA(I) Package: *; EIA(M) Package: *; Part Ref: DSC1001DI1-033.3300; Voltage: 1.7V to 3.6V; Comment_1: *; Current: *; RoHs: True; Tolerance: *; Operating Temp: -40 to +85 C
U12 = NC7WZ07FHX: UHS Dual Buffer, Tiny Logic, 1.65 to 5.5V, -40 to +85 C, 200mW, MicroPak2-6; Manufacturer 1: Fairchild Semiconductor; ASSY: USED; Power: Pow; Current: + - 24mA; Status: Active; EIA(I) Package: *; EIA(M) Package: *; Part Ref: NC7WZ07FHX; Tolerance: *; Voltage: 1.65 to 5.5V; Package: SOT-23-5; RoHs: True; Value: NC7WZ07FHX; Operating Temp: -40 to +85 C; Mfg Part Number 1: NC7WZ07FHX
U26-U30 = SN74LVC1G125DCK: Tristate buffer, 1.65 to 5.5V, +/- 24mA, -40 to +125 C, 150mW, SC70; Manufacturer 1: Texas Instrument; ASSY: USED; Current: + - 24mA; Comment_1: Com; Status: Active; EIA(I) Package: *; EIA(M) Package: *; Part Ref: SN74LVC1G125DCK; Power: 150mW; Tolerance: *; Voltage: 1.65 to 5.5V; Package: SC70; RoHs: True; Mfg Part Number 1: SN74LVC1G125DCK; Datasheet 1: ..\datasheet\Logic\TI\SN74LVC1G125DCK\2013-08-14

## Sheet Bank34-35.SchDoc: 02290_Sonoma_Controller
size B; ApprovedBy: J Johnson; CheckedBy: J Johnson; Author: sdfasdfdfAEFfasdFfaF; DrawnBy: J Johnson; Organization: Opsero Electronic Design; Address1: 21-915 Av. Marguerite-Bourgeoys; Address2: Québec (QC); Address3: G1S 3X4; DocumentNumber: OP009-001-SCH; Revision: B-1; SheetNumber: 08; SheetTotal: 16; Tel1: (581) 308-8830; Tel2: (581) 308-8830; Project: 02290_Sonoma_Controller; CheckedDate: yyyy-mm-dd; Sheet: Bank34 & Bank35; PageSetup: Record=PageOptions|CenterHorizontal=True|CenterVertical=True|PrintScale=1.08|XCorrection=1.00|YCorrection=1.00|PrintKind=0|BorderSize=5000000|LeftOffset=0|BottomOffset=0|Orientation=2|PaperLength=1000|PaperWidth=1000|Scale=100|PaperSource=7|PrintQuality=-4|MediaType=1|DitherType=10|PaperKind=Tabloid     [11 x 17 in]|PrintScaleMode=1; DrawDate: 2013-12-13; SchTitle: 02290_Sonoma_Controller; RevDescription: Removed QSPI, JP4/5, temp mon, JP6, U31; RevDate: 2019-05-24; RevBy: J Johnson; RevDescription2: Replaced D1 with RB521S30, J2 with L834-1G1T-S7; RevDescription3: Replaced FETs with TSM900N06CW RPG
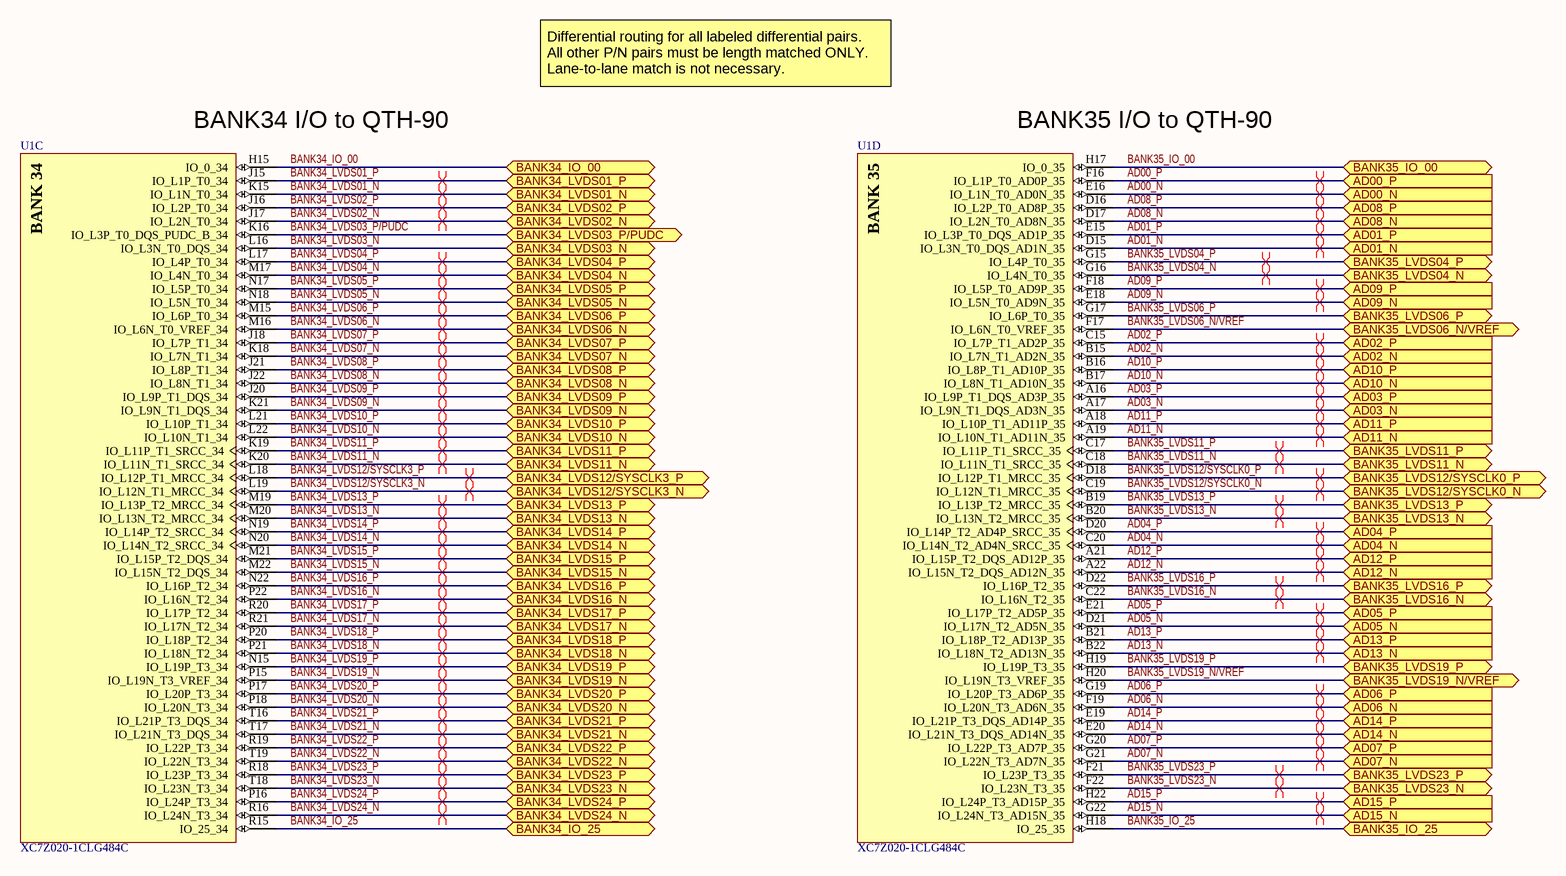
[diagram p2: Bank34-35.SchDoc]

### Parts
U1  XC7Z020-1CLG484C  [CLG484]  (parts C,D of 10)

### Ports
AD00_N (in), AD00_P (in), AD01_N (in), AD01_P (in), AD02_N (in), AD02_P (in), AD03_N (in), AD03_P (in), AD04_N (in), AD04_P (in), AD05_N (in), AD05_P (in), AD06_N (in), AD06_P (in), AD07_N (in), AD07_P (in), AD08_N (in), AD08_P (in), AD09_N (in), AD09_P (in), AD10_N (in), AD10_P (in), AD11_N (in), AD11_P (in), AD12_N (in), AD12_P (in), AD13_N (in), AD13_P (in), AD14_N (in), AD14_P (in), AD15_N (in), AD15_P (in), BANK34_IO_00 (bidir), BANK34_IO_25 (bidir), BANK34_LVDS01_N (bidir), BANK34_LVDS01_P (bidir), BANK34_LVDS02_N (bidir), BANK34_LVDS02_P (bidir), BANK34_LVDS03_N (bidir), BANK34_LVDS03_P/PUDC (bidir), BANK34_LVDS04_N (bidir), BANK34_LVDS04_P (bidir), BANK34_LVDS05_N (bidir), BANK34_LVDS05_P (bidir), BANK34_LVDS06_N (bidir), BANK34_LVDS06_P (bidir), BANK34_LVDS07_N (bidir), BANK34_LVDS07_P (bidir), BANK34_LVDS08_N (bidir), BANK34_LVDS08_P (bidir), BANK34_LVDS09_N (bidir), BANK34_LVDS09_P (bidir), BANK34_LVDS10_N (bidir), BANK34_LVDS10_P (bidir), BANK34_LVDS11_N (bidir), BANK34_LVDS11_P (bidir), BANK34_LVDS12/SYSCLK3_N (bidir), BANK34_LVDS12/SYSCLK3_P (bidir), BANK34_LVDS13_N (bidir), BANK34_LVDS13_P (bidir), BANK34_LVDS14_N (bidir), BANK34_LVDS14_P (bidir), BANK34_LVDS15_N (bidir), BANK34_LVDS15_P (bidir), BANK34_LVDS16_N (bidir), BANK34_LVDS16_P (bidir), BANK34_LVDS17_N (bidir), BANK34_LVDS17_P (bidir), BANK34_LVDS18_N (bidir), BANK34_LVDS18_P (bidir), BANK34_LVDS19_N (bidir), BANK34_LVDS19_P (bidir), BANK34_LVDS20_N (bidir), BANK34_LVDS20_P (bidir), BANK34_LVDS21_N (bidir), BANK34_LVDS21_P (bidir), BANK34_LVDS22_N (bidir), BANK34_LVDS22_P (bidir), BANK34_LVDS23_N (bidir), BANK34_LVDS23_P (bidir), BANK34_LVDS24_N (bidir), BANK34_LVDS24_P (bidir), BANK35_IO_00 (bidir), BANK35_IO_25 (bidir), BANK35_LVDS04_N (bidir), BANK35_LVDS04_P (bidir), BANK35_LVDS06_N/VREF (bidir), BANK35_LVDS06_P (bidir), BANK35_LVDS11_N (bidir), BANK35_LVDS11_P (bidir), BANK35_LVDS12/SYSCLK0_N (bidir), BANK35_LVDS12/SYSCLK0_P (bidir), BANK35_LVDS13_N (bidir), BANK35_LVDS13_P (bidir), BANK35_LVDS16_N (bidir), BANK35_LVDS16_P (bidir), BANK35_LVDS19_N/VREF (bidir), BANK35_LVDS19_P (bidir), BANK35_LVDS23_N (bidir), BANK35_LVDS23_P (bidir)

### Nets
AD00_N: U1.E16(IO_L1N_T0_AD0N_35) ; port AD00_N
AD00_P: U1.F16(IO_L1P_T0_AD0P_35) ; port AD00_P
AD01_N: U1.D15(IO_L3N_T0_DQS_AD1N_35) ; port AD01_N
AD01_P: U1.E15(IO_L3P_T0_DQS_AD1P_35) ; port AD01_P
AD02_N: U1.B15(IO_L7N_T1_AD2N_35) ; port AD02_N
AD02_P: U1.C15(IO_L7P_T1_AD2P_35) ; port AD02_P
AD03_N: U1.A17(IO_L9N_T1_DQS_AD3N_35) ; port AD03_N
AD03_P: U1.A16(IO_L9P_T1_DQS_AD3P_35) ; port AD03_P
AD04_N: U1.C20(IO_L14N_T2_AD4N_SRCC_35) ; port AD04_N
AD04_P: U1.D20(IO_L14P_T2_AD4P_SRCC_35) ; port AD04_P
AD05_N: U1.D21(IO_L17N_T2_AD5N_35) ; port AD05_N
AD05_P: U1.E21(IO_L17P_T2_AD5P_35) ; port AD05_P
AD06_N: U1.F19(IO_L20N_T3_AD6N_35) ; port AD06_N
AD06_P: U1.G19(IO_L20P_T3_AD6P_35) ; port AD06_P
AD07_N: U1.G21(IO_L22N_T3_AD7N_35) ; port AD07_N
AD07_P: U1.G20(IO_L22P_T3_AD7P_35) ; port AD07_P
AD08_N: U1.D17(IO_L2N_T0_AD8N_35) ; port AD08_N
AD08_P: U1.D16(IO_L2P_T0_AD8P_35) ; port AD08_P
AD09_N: U1.E18(IO_L5N_T0_AD9N_35) ; port AD09_N
AD09_P: U1.F18(IO_L5P_T0_AD9P_35) ; port AD09_P
AD10_N: U1.B17(IO_L8N_T1_AD10N_35) ; port AD10_N
AD10_P: U1.B16(IO_L8P_T1_AD10P_35) ; port AD10_P
AD11_N: U1.A19(IO_L10N_T1_AD11N_35) ; port AD11_N
AD11_P: U1.A18(IO_L10P_T1_AD11P_35) ; port AD11_P
AD12_N: U1.A22(IO_L15N_T2_DQS_AD12N_35) ; port AD12_N
AD12_P: U1.A21(IO_L15P_T2_DQS_AD12P_35) ; port AD12_P
AD13_N: U1.B22(IO_L18N_T2_AD13N_35) ; port AD13_N
AD13_P: U1.B21(IO_L18P_T2_AD13P_35) ; port AD13_P
AD14_N: U1.E20(IO_L21N_T3_DQS_AD14N_35) ; port AD14_N
AD14_P: U1.E19(IO_L21P_T3_DQS_AD14P_35) ; port AD14_P
AD15_N: U1.G22(IO_L24N_T3_AD15N_35) ; port AD15_N
AD15_P: U1.H22(IO_L24P_T3_AD15P_35) ; port AD15_P
BANK34_IO_00: U1.H15(IO_0_34) ; port BANK34_IO_00
BANK34_IO_25: U1.R15(IO_25_34) ; port BANK34_IO_25
BANK34_LVDS01_N: U1.K15(IO_L1N_T0_34) ; port BANK34_LVDS01_N
BANK34_LVDS01_P: U1.J15(IO_L1P_T0_34) ; port BANK34_LVDS01_P
BANK34_LVDS02_N: U1.J17(IO_L2N_T0_34) ; port BANK34_LVDS02_N
BANK34_LVDS02_P: U1.J16(IO_L2P_T0_34) ; port BANK34_LVDS02_P
BANK34_LVDS03_N: U1.L16(IO_L3N_T0_DQS_34) ; port BANK34_LVDS03_N
BANK34_LVDS03_P/PUDC: U1.K16(IO_L3P_T0_DQS_PUDC_B_34) ; port BANK34_LVDS03_P/PUDC
BANK34_LVDS04_N: U1.M17(IO_L4N_T0_34) ; port BANK34_LVDS04_N
BANK34_LVDS04_P: U1.L17(IO_L4P_T0_34) ; port BANK34_LVDS04_P
BANK34_LVDS05_N: U1.N18(IO_L5N_T0_34) ; port BANK34_LVDS05_N
BANK34_LVDS05_P: U1.N17(IO_L5P_T0_34) ; port BANK34_LVDS05_P
BANK34_LVDS06_N: U1.M16(IO_L6N_T0_VREF_34) ; port BANK34_LVDS06_N
BANK34_LVDS06_P: U1.M15(IO_L6P_T0_34) ; port BANK34_LVDS06_P
BANK34_LVDS07_N: U1.K18(IO_L7N_T1_34) ; port BANK34_LVDS07_N
BANK34_LVDS07_P: U1.J18(IO_L7P_T1_34) ; port BANK34_LVDS07_P
BANK34_LVDS08_N: U1.J22(IO_L8N_T1_34) ; port BANK34_LVDS08_N
BANK34_LVDS08_P: U1.J21(IO_L8P_T1_34) ; port BANK34_LVDS08_P
BANK34_LVDS09_N: U1.K21(IO_L9N_T1_DQS_34) ; port BANK34_LVDS09_N
BANK34_LVDS09_P: U1.J20(IO_L9P_T1_DQS_34) ; port BANK34_LVDS09_P
BANK34_LVDS10_N: U1.L22(IO_L10N_T1_34) ; port BANK34_LVDS10_N
BANK34_LVDS10_P: U1.L21(IO_L10P_T1_34) ; port BANK34_LVDS10_P
BANK34_LVDS11_N: U1.K20(IO_L11N_T1_SRCC_34) ; port BANK34_LVDS11_N
BANK34_LVDS11_P: U1.K19(IO_L11P_T1_SRCC_34) ; port BANK34_LVDS11_P
BANK34_LVDS12/SYSCLK3_N: U1.L19(IO_L12N_T1_MRCC_34) ; port BANK34_LVDS12/SYSCLK3_N
BANK34_LVDS12/SYSCLK3_P: U1.L18(IO_L12P_T1_MRCC_34) ; port BANK34_LVDS12/SYSCLK3_P
BANK34_LVDS13_N: U1.M20(IO_L13N_T2_MRCC_34) ; port BANK34_LVDS13_N
BANK34_LVDS13_P: U1.M19(IO_L13P_T2_MRCC_34) ; port BANK34_LVDS13_P
BANK34_LVDS14_N: U1.N20(IO_L14N_T2_SRCC_34) ; port BANK34_LVDS14_N
BANK34_LVDS14_P: U1.N19(IO_L14P_T2_SRCC_34) ; port BANK34_LVDS14_P
BANK34_LVDS15_N: U1.M22(IO_L15N_T2_DQS_34) ; port BANK34_LVDS15_N
BANK34_LVDS15_P: U1.M21(IO_L15P_T2_DQS_34) ; port BANK34_LVDS15_P
BANK34_LVDS16_N: U1.P22(IO_L16N_T2_34) ; port BANK34_LVDS16_N
BANK34_LVDS16_P: U1.N22(IO_L16P_T2_34) ; port BANK34_LVDS16_P
BANK34_LVDS17_N: U1.R21(IO_L17N_T2_34) ; port BANK34_LVDS17_N
BANK34_LVDS17_P: U1.R20(IO_L17P_T2_34) ; port BANK34_LVDS17_P
BANK34_LVDS18_N: U1.P21(IO_L18N_T2_34) ; port BANK34_LVDS18_N
BANK34_LVDS18_P: U1.P20(IO_L18P_T2_34) ; port BANK34_LVDS18_P
BANK34_LVDS19_N: U1.P15(IO_L19N_T3_VREF_34) ; port BANK34_LVDS19_N
BANK34_LVDS19_P: U1.N15(IO_L19P_T3_34) ; port BANK34_LVDS19_P
BANK34_LVDS20_N: U1.P18(IO_L20N_T3_34) ; port BANK34_LVDS20_N
BANK34_LVDS20_P: U1.P17(IO_L20P_T3_34) ; port BANK34_LVDS20_P
BANK34_LVDS21_N: U1.T17(IO_L21N_T3_DQS_34) ; port BANK34_LVDS21_N
BANK34_LVDS21_P: U1.T16(IO_L21P_T3_DQS_34) ; port BANK34_LVDS21_P
BANK34_LVDS22_N: U1.T19(IO_L22N_T3_34) ; port BANK34_LVDS22_N
BANK34_LVDS22_P: U1.R19(IO_L22P_T3_34) ; port BANK34_LVDS22_P
BANK34_LVDS23_N: U1.T18(IO_L23N_T3_34) ; port BANK34_LVDS23_N
BANK34_LVDS23_P: U1.R18(IO_L23P_T3_34) ; port BANK34_LVDS23_P
BANK34_LVDS24_N: U1.R16(IO_L24N_T3_34) ; port BANK34_LVDS24_N
BANK34_LVDS24_P: U1.P16(IO_L24P_T3_34) ; port BANK34_LVDS24_P
BANK35_IO_00: U1.H17(IO_0_35) ; port BANK35_IO_00
BANK35_IO_25: U1.H18(IO_25_35) ; port BANK35_IO_25
BANK35_LVDS04_N: U1.G16(IO_L4N_T0_35) ; port BANK35_LVDS04_N
BANK35_LVDS04_P: U1.G15(IO_L4P_T0_35) ; port BANK35_LVDS04_P
BANK35_LVDS06_N/VREF: U1.F17(IO_L6N_T0_VREF_35) ; port BANK35_LVDS06_N/VREF
BANK35_LVDS06_P: U1.G17(IO_L6P_T0_35) ; port BANK35_LVDS06_P
BANK35_LVDS11_N: U1.C18(IO_L11N_T1_SRCC_35) ; port BANK35_LVDS11_N
BANK35_LVDS11_P: U1.C17(IO_L11P_T1_SRCC_35) ; port BANK35_LVDS11_P
BANK35_LVDS12/SYSCLK0_N: U1.C19(IO_L12N_T1_MRCC_35) ; port BANK35_LVDS12/SYSCLK0_N
BANK35_LVDS12/SYSCLK0_P: U1.D18(IO_L12P_T1_MRCC_35) ; port BANK35_LVDS12/SYSCLK0_P
BANK35_LVDS13_N: U1.B20(IO_L13N_T2_MRCC_35) ; port BANK35_LVDS13_N
BANK35_LVDS13_P: U1.B19(IO_L13P_T2_MRCC_35) ; port BANK35_LVDS13_P
BANK35_LVDS16_N: U1.C22(IO_L16N_T2_35) ; port BANK35_LVDS16_N
BANK35_LVDS16_P: U1.D22(IO_L16P_T2_35) ; port BANK35_LVDS16_P
BANK35_LVDS19_N/VREF: U1.H20(IO_L19N_T3_VREF_35) ; port BANK35_LVDS19_N/VREF
BANK35_LVDS19_P: U1.H19(IO_L19P_T3_35) ; port BANK35_LVDS19_P
BANK35_LVDS23_N: U1.F22(IO_L23N_T3_35) ; port BANK35_LVDS23_N
BANK35_LVDS23_P: U1.F21(IO_L23P_T3_35) ; port BANK35_LVDS23_P

### Layout directives
differential pair: AD00_N, AD00_P, AD01_N, AD01_P, AD02_N, AD02_P, AD03_N, AD03_P, AD04_N, AD04_P, AD05_N, AD05_P, AD06_N, AD06_P, AD07_N, AD07_P, AD08_N, AD08_P, AD09_N, AD09_P, AD10_N, AD10_P, AD11_N, AD11_P, AD12_N, AD12_P, AD13_N, AD13_P, AD14_N, AD14_P, AD15_N, AD15_P, BANK34_LVDS01_N, BANK34_LVDS01_P, BANK34_LVDS02_N, BANK34_LVDS02_P, BANK34_LVDS04_N, BANK34_LVDS04_P, BANK34_LVDS05_N, BANK34_LVDS05_P, BANK34_LVDS06_N, BANK34_LVDS06_P, BANK34_LVDS07_N, BANK34_LVDS07_P, BANK34_LVDS08_N, BANK34_LVDS08_P, BANK34_LVDS09_N, BANK34_LVDS09_P, BANK34_LVDS10_N, BANK34_LVDS10_P, BANK34_LVDS11_N, BANK34_LVDS11_P, BANK34_LVDS12/SYSCLK3_N, BANK34_LVDS12/SYSCLK3_P, BANK34_LVDS13_N, BANK34_LVDS13_P, BANK34_LVDS14_N, BANK34_LVDS14_P, BANK34_LVDS15_N, BANK34_LVDS15_P, BANK34_LVDS16_N, BANK34_LVDS16_P, BANK34_LVDS17_N, BANK34_LVDS17_P, BANK34_LVDS18_N, BANK34_LVDS18_P, BANK34_LVDS19_N, BANK34_LVDS19_P, BANK34_LVDS20_N, BANK34_LVDS20_P, BANK34_LVDS21_N, BANK34_LVDS21_P, BANK34_LVDS22_N, BANK34_LVDS22_P, BANK34_LVDS23_N, BANK34_LVDS23_P, BANK34_LVDS24_N, BANK34_LVDS24_P, BANK35_LVDS04_N, BANK35_LVDS04_P, BANK35_LVDS11_N, BANK35_LVDS11_P, BANK35_LVDS12/SYSCLK0_N, BANK35_LVDS12/SYSCLK0_P, BANK35_LVDS13_N, BANK35_LVDS13_P, BANK35_LVDS16_N, BANK35_LVDS16_P, BANK35_LVDS23_N, BANK35_LVDS23_P

### Notes on the sheet
- Differential routing for all labeled differential pairs.
  All other P/N pairs must be length matched ONLY.
  Lane-to-lane match is not necessary.
- (near U1) BANK34 I/O to QTH-90
- (near U1) BANK35 I/O to QTH-90
- REV.
- DESCRIPTION
- DATE
- APPROVED
- Incal Inc.
- SHEET
- TITLE
- CONFIG.
- PROJECT
- SIZE
- SCH P/N.
- DRAWN
- B
- OF
- (in symbol XC7Z020-1CLG484C, part C) BANK 34
- (in symbol XC7Z020-1CLG484C, part D) BANK 35

### Library data of the parts
U1 = XC7Z020-1CLG484C: as U1 on sheet QSPIFlash; DatasheetVersion: v1.2; PackageVersion: Rev 1.1; PackageReference: CLG484; PackageDescription: Wire-Bond Chip-Scale BGA, Body 19 x 19 mm, 0.8 mm Pitch; Generic Part Number: XC7Z020; RoHS: True; Mounting Technology: Surface Mount; Code_JEDEC: MO-275-PPAA-2; PartNumber: XC7Z020-1CLG484C; ComponentLink1Description: Datasheet; ComponentLink1URL: http://www.xilinx.com/support/documentation/data_sheets/ds190-Zynq-7000-Overview.pdf; ComponentLink2Description: Package Specification; ComponentLink2URL: http://www.xilinx.com/support/documentation/user_guides/ug865-Zynq-7000-Pkg-Pinout.pdf; ComponentLink3Description: DC and AC Switching Characteristics; ComponentLink3URL: http://www.xilinx.com/support/documentation/data_sheets/ds187-XC7Z010-XC7Z020-Data-Sheet.pdf; ComponentLink4Description: Package File; ComponentLink4URL: http://www.xilinx.com/support/packagefiles/z7packages/xc7z020clg484pkg.txt; ComponentLink5Description: Packaging and Pinout; ComponentLink5URL: http://www.xilinx.com/support/documentation/user_guides/ug865-Zynq-7000-Pkg-Pinout.pdf; ComponentLink6Description: PCB and Layout Guide; ComponentLink6URL: http://www.xilinx.com/support/documentation/user_guides/ug483_7Series_PCB.pdf; Part Ref: XC7Z020-1CLG484C; Status: Active; Value: XC7Z020-1CLG484C; Manufacturer 1: Xilinx; Mfg Part Number 1: XC7Z020-1CLG484C; Package: CLG484